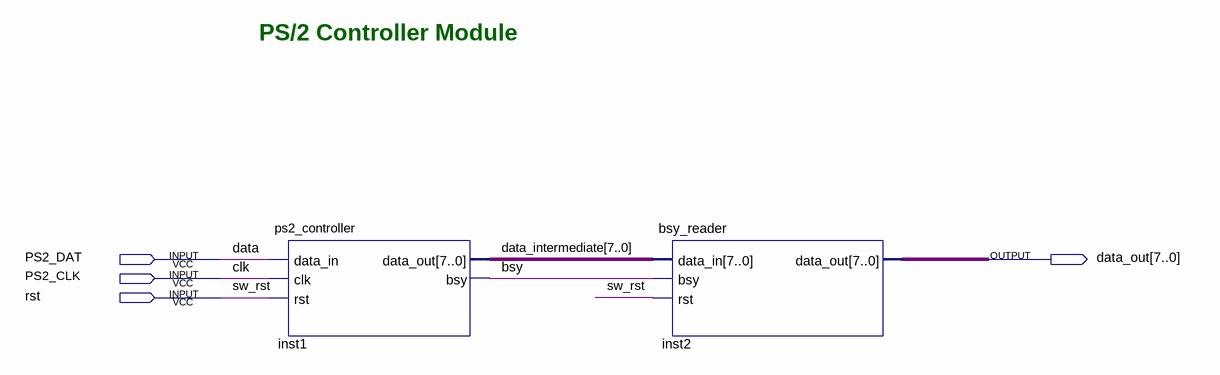
[diagram p0: schematic sheet]
// Quartus schematic PS2controller.bdf as structural Verilog: 2 symbols, 4 pins
module PS2controller (
  input  PS2_DAT,
  input  PS2_CLK,
  input  rst,
  output [7:0] data_out
);

  wire bsy;
  wire [7:0] data_intermediate;

  ps2_controller inst1 (.data_in(PS2_DAT), .clk(PS2_CLK), .rst(rst), .data_out(data_intermediate), .bsy(bsy));
  bsy_reader inst2 (.data_in(data_intermediate), .bsy(bsy), .rst(rst), .data_out(data_out));

  // Other names for the same wires on the sheet: clk = PS2_CLK; data = PS2_DAT; sw_rst = rst

  // Notes on the sheet:
  //   PS/2 Controller Module
endmodule
